# EAGLE design PatchPanel (EAGLE 6.5.0)
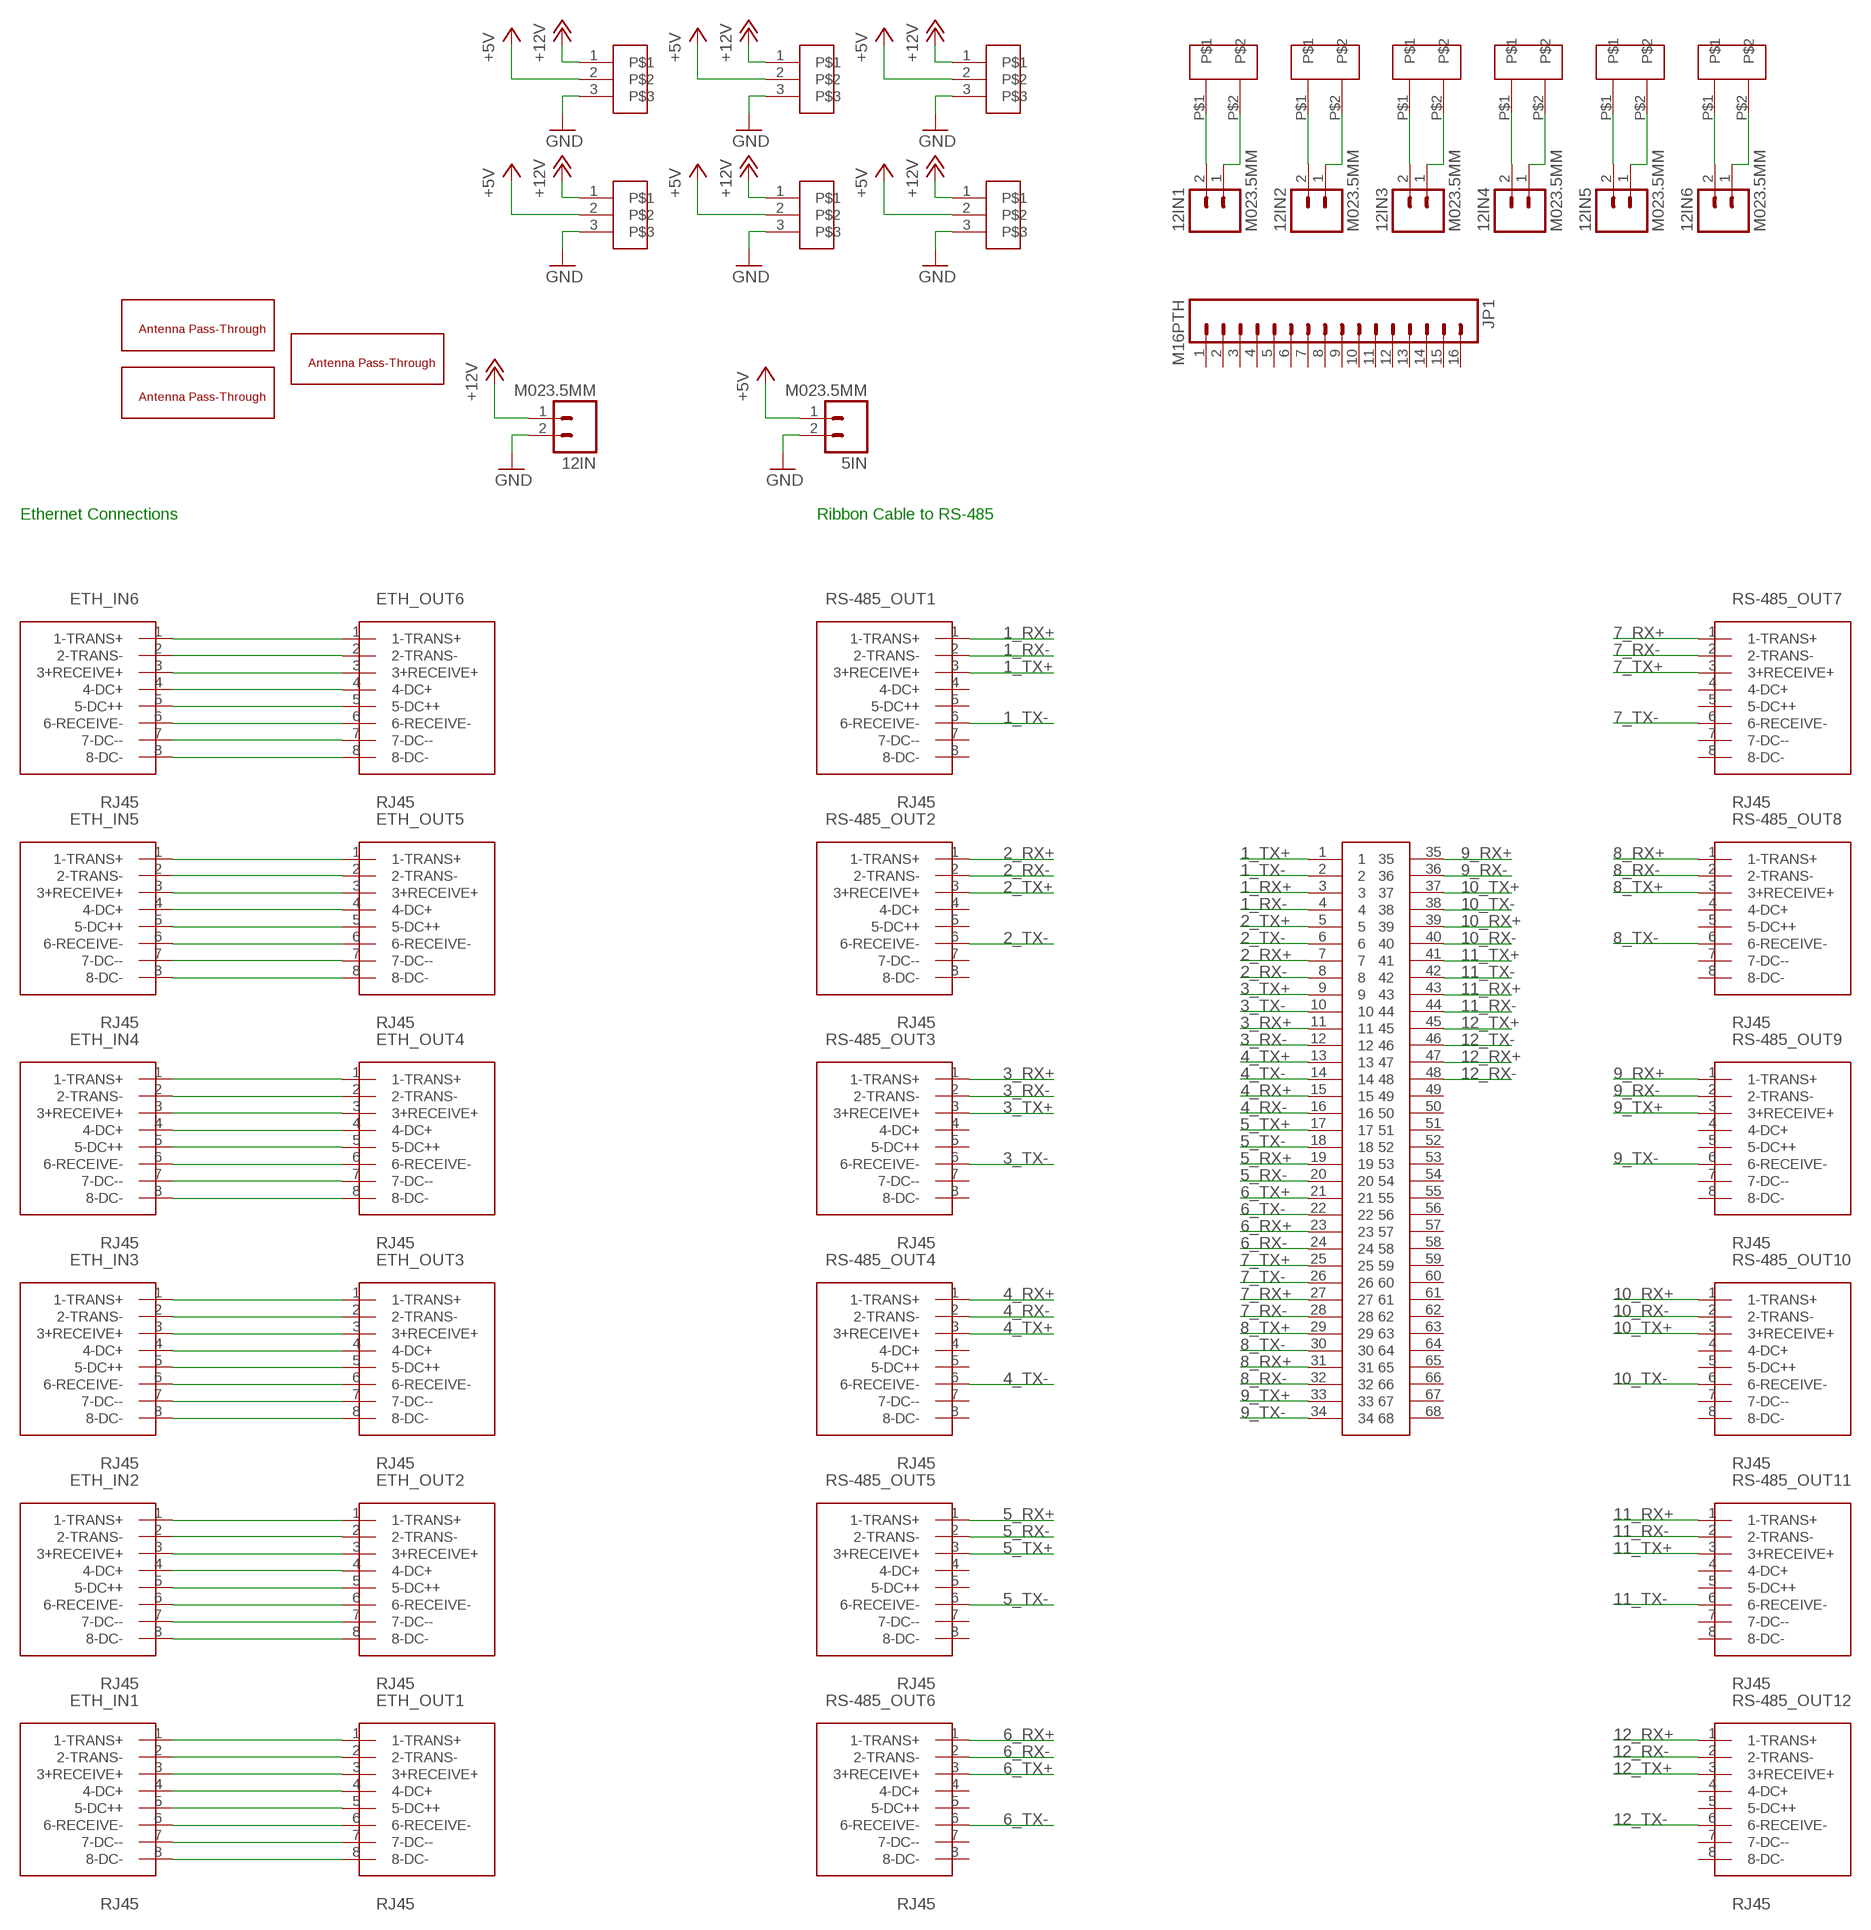
[diagram p0: schematic, sheet 1]

## Parts
5IN  M023.5MM  [SCREWTERMINAL-3.5MM-2]
12IN  M023.5MM  [SCREWTERMINAL-3.5MM-2]
12IN1  M023.5MM  [SCREWTERMINAL-3.5MM-2]
12IN2  M023.5MM  [SCREWTERMINAL-3.5MM-2]
12IN3  M023.5MM  [SCREWTERMINAL-3.5MM-2]
12IN4  M023.5MM  [SCREWTERMINAL-3.5MM-2]
12IN5  M023.5MM  [SCREWTERMINAL-3.5MM-2]
12IN6  M023.5MM  [SCREWTERMINAL-3.5MM-2]
ETH_IN1  RJ45  [RJ45-CAT5E]
ETH_IN2  RJ45  [RJ45-CAT5E]
ETH_IN3  RJ45  [RJ45-CAT5E]
ETH_IN4  RJ45  [RJ45-CAT5E]
ETH_IN5  RJ45  [RJ45-CAT5E]
ETH_IN6  RJ45  [RJ45-CAT5E]
ETH_OUT1  RJ45  [RJ45-CAT5E]
ETH_OUT2  RJ45  [RJ45-CAT5E]
ETH_OUT3  RJ45  [RJ45-CAT5E]
ETH_OUT4  RJ45  [RJ45-CAT5E]
ETH_OUT5  RJ45  [RJ45-CAT5E]
ETH_OUT6  RJ45  [RJ45-CAT5E]
JP1  M16PTH  [1X16]
RS-485_OUT1  RJ45  [RJ45-CAT5E]
RS-485_OUT2  RJ45  [RJ45-CAT5E]
RS-485_OUT3  RJ45  [RJ45-CAT5E]
RS-485_OUT4  RJ45  [RJ45-CAT5E]
RS-485_OUT5  RJ45  [RJ45-CAT5E]
RS-485_OUT6  RJ45  [RJ45-CAT5E]
RS-485_OUT7  RJ45  [RJ45-CAT5E]
RS-485_OUT8  RJ45  [RJ45-CAT5E]
RS-485_OUT9  RJ45  [RJ45-CAT5E]
RS-485_OUT10  RJ45  [RJ45-CAT5E]
RS-485_OUT11  RJ45  [RJ45-CAT5E]
RS-485_OUT12  RJ45  [RJ45-CAT5E]
U$1  TB60050685100  [60050685100]
U$2  3PIN  [0.93"]
U$3  3PIN  [0.93"]
U$4  3PIN  [0.93"]
U$5  3PIN  [0.93"]
U$6  3PIN  [0.93"]
U$7  3PIN  [0.93"]
U$8  MLX-2  [42002-2]
U$9  MLX-2  [42002-2]
U$10  MLX-2  [42002-2]
U$11  MLX-2  [42002-2]
U$12  MLX-2  [42002-2]
U$13  MLX-2  [42002-2]
U$14  N-TYPE-THRU  [N-TYPE]
U$15  N-TYPE-THRU  [N-TYPE]
U$16  SMA-THRU  [SMA]

## Nets
1_RX+: RS-485_OUT1.1(1-TRANS+) U$1.3
1_RX-: RS-485_OUT1.2(2-TRANS-) U$1.4
1_TX+: RS-485_OUT1.3(3+RECEIVE+) U$1.1
1_TX-: RS-485_OUT1.6(6-RECEIVE-) U$1.2
2_RX+: RS-485_OUT2.1(1-TRANS+) U$1.7
2_RX-: RS-485_OUT2.2(2-TRANS-) U$1.8
2_TX+: RS-485_OUT2.3(3+RECEIVE+) U$1.5
2_TX-: RS-485_OUT2.6(6-RECEIVE-) U$1.6
3_RX+: RS-485_OUT3.1(1-TRANS+) U$1.11
3_RX-: RS-485_OUT3.2(2-TRANS-) U$1.12
3_TX+: RS-485_OUT3.3(3+RECEIVE+) U$1.9
3_TX-: RS-485_OUT3.6(6-RECEIVE-) U$1.10
4_RX+: RS-485_OUT4.1(1-TRANS+) U$1.15
4_RX-: RS-485_OUT4.2(2-TRANS-) U$1.16
4_TX+: RS-485_OUT4.3(3+RECEIVE+) U$1.13
4_TX-: RS-485_OUT4.6(6-RECEIVE-) U$1.14
5_RX+: RS-485_OUT5.1(1-TRANS+) U$1.19
5_RX-: RS-485_OUT5.2(2-TRANS-) U$1.20
5_TX+: RS-485_OUT5.3(3+RECEIVE+) U$1.17
5_TX-: RS-485_OUT5.6(6-RECEIVE-) U$1.18
6_RX+: RS-485_OUT6.1(1-TRANS+) U$1.23
6_RX-: RS-485_OUT6.2(2-TRANS-) U$1.24
6_TX+: RS-485_OUT6.3(3+RECEIVE+) U$1.21
6_TX-: RS-485_OUT6.6(6-RECEIVE-) U$1.22
7_RX+: RS-485_OUT7.1(1-TRANS+) U$1.27
7_RX-: RS-485_OUT7.2(2-TRANS-) U$1.28
7_TX+: RS-485_OUT7.3(3+RECEIVE+) U$1.25
7_TX-: RS-485_OUT7.6(6-RECEIVE-) U$1.26
8_RX+: RS-485_OUT8.1(1-TRANS+) U$1.31
8_RX-: RS-485_OUT8.2(2-TRANS-) U$1.32
8_TX+: RS-485_OUT8.3(3+RECEIVE+) U$1.29
8_TX-: RS-485_OUT8.6(6-RECEIVE-) U$1.30
9_RX+: RS-485_OUT9.1(1-TRANS+) U$1.35
9_RX-: RS-485_OUT9.2(2-TRANS-) U$1.36
9_TX+: RS-485_OUT9.3(3+RECEIVE+) U$1.33
9_TX-: RS-485_OUT9.6(6-RECEIVE-) U$1.34
10_RX+: RS-485_OUT10.1(1-TRANS+) U$1.39
10_RX-: RS-485_OUT10.2(2-TRANS-) U$1.40
10_TX+: RS-485_OUT10.3(3+RECEIVE+) U$1.37
10_TX-: RS-485_OUT10.6(6-RECEIVE-) U$1.38
11_RX+: RS-485_OUT11.1(1-TRANS+) U$1.43
11_RX-: RS-485_OUT11.2(2-TRANS-) U$1.44
11_TX+: RS-485_OUT11.3(3+RECEIVE+) U$1.41
11_TX-: RS-485_OUT11.6(6-RECEIVE-) U$1.42
12_RX+: RS-485_OUT12.1(1-TRANS+) U$1.47
12_RX-: RS-485_OUT12.2(2-TRANS-) U$1.48
12_TX+: RS-485_OUT12.3(3+RECEIVE+) U$1.45
12_TX-: RS-485_OUT12.6(6-RECEIVE-) U$1.46
+5V: 5IN.1 U$2.2 U$3.2 U$4.2 U$5.2 U$6.2 U$7.2
+12V: 12IN.1 U$2.1 U$3.1 U$4.1 U$5.1 U$6.1 U$7.1
GND: 5IN.2 12IN.2 U$2.3 U$3.3 U$4.3 U$5.3 U$6.3 U$7.3
N$1: ETH_IN1.1(1-TRANS+) ETH_OUT1.1(1-TRANS+)
N$2: ETH_IN1.2(2-TRANS-) ETH_OUT1.2(2-TRANS-)
N$3: ETH_IN1.3(3+RECEIVE+) ETH_OUT1.3(3+RECEIVE+)
N$4: ETH_IN1.4(4-DC+) ETH_OUT1.4(4-DC+)
N$5: ETH_IN1.5(5-DC++) ETH_OUT1.5(5-DC++)
N$6: ETH_IN1.6(6-RECEIVE-) ETH_OUT1.6(6-RECEIVE-)
N$7: ETH_IN1.7(7-DC--) ETH_OUT1.7(7-DC--)
N$8: ETH_IN1.8(8-DC-) ETH_OUT1.8(8-DC-)
N$9: ETH_IN2.1(1-TRANS+) ETH_OUT2.1(1-TRANS+)
N$10: ETH_IN2.2(2-TRANS-) ETH_OUT2.2(2-TRANS-)
N$11: ETH_IN2.3(3+RECEIVE+) ETH_OUT2.3(3+RECEIVE+)
N$12: ETH_IN2.4(4-DC+) ETH_OUT2.4(4-DC+)
N$13: ETH_IN2.5(5-DC++) ETH_OUT2.5(5-DC++)
N$14: ETH_IN2.6(6-RECEIVE-) ETH_OUT2.6(6-RECEIVE-)
N$15: ETH_IN2.7(7-DC--) ETH_OUT2.7(7-DC--)
N$16: ETH_IN2.8(8-DC-) ETH_OUT2.8(8-DC-)
N$17: ETH_IN3.1(1-TRANS+) ETH_OUT3.1(1-TRANS+)
N$18: ETH_IN3.2(2-TRANS-) ETH_OUT3.2(2-TRANS-)
N$19: ETH_IN3.3(3+RECEIVE+) ETH_OUT3.3(3+RECEIVE+)
N$20: ETH_IN3.4(4-DC+) ETH_OUT3.4(4-DC+)
N$21: ETH_IN3.5(5-DC++) ETH_OUT3.5(5-DC++)
N$22: ETH_IN3.6(6-RECEIVE-) ETH_OUT3.6(6-RECEIVE-)
N$23: ETH_IN3.7(7-DC--) ETH_OUT3.7(7-DC--)
N$24: ETH_IN3.8(8-DC-) ETH_OUT3.8(8-DC-)
N$25: ETH_IN4.8(8-DC-) ETH_OUT4.8(8-DC-)
N$26: ETH_IN4.7(7-DC--) ETH_OUT4.7(7-DC--)
N$27: ETH_IN4.6(6-RECEIVE-) ETH_OUT4.6(6-RECEIVE-)
N$28: ETH_IN4.5(5-DC++) ETH_OUT4.5(5-DC++)
N$29: ETH_IN4.4(4-DC+) ETH_OUT4.4(4-DC+)
N$30: ETH_IN4.3(3+RECEIVE+) ETH_OUT4.3(3+RECEIVE+)
N$31: ETH_IN4.2(2-TRANS-) ETH_OUT4.2(2-TRANS-)
N$32: ETH_IN4.1(1-TRANS+) ETH_OUT4.1(1-TRANS+)
N$33: ETH_IN5.8(8-DC-) ETH_OUT5.8(8-DC-)
N$34: ETH_IN5.7(7-DC--) ETH_OUT5.7(7-DC--)
N$35: ETH_IN5.6(6-RECEIVE-) ETH_OUT5.6(6-RECEIVE-)
N$36: ETH_IN5.5(5-DC++) ETH_OUT5.5(5-DC++)
N$37: ETH_IN5.4(4-DC+) ETH_OUT5.4(4-DC+)
N$38: ETH_IN5.3(3+RECEIVE+) ETH_OUT5.3(3+RECEIVE+)
N$39: ETH_IN5.2(2-TRANS-) ETH_OUT5.2(2-TRANS-)
N$40: ETH_IN5.1(1-TRANS+) ETH_OUT5.1(1-TRANS+)
N$41: ETH_IN6.1(1-TRANS+) ETH_OUT6.1(1-TRANS+)
N$42: ETH_IN6.2(2-TRANS-) ETH_OUT6.2(2-TRANS-)
N$43: ETH_IN6.3(3+RECEIVE+) ETH_OUT6.3(3+RECEIVE+)
N$44: ETH_IN6.4(4-DC+) ETH_OUT6.4(4-DC+)
N$45: ETH_IN6.5(5-DC++) ETH_OUT6.5(5-DC++)
N$46: ETH_IN6.6(6-RECEIVE-) ETH_OUT6.6(6-RECEIVE-)
N$47: ETH_IN6.7(7-DC--) ETH_OUT6.7(7-DC--)
N$48: ETH_IN6.8(8-DC-) ETH_OUT6.8(8-DC-)
N$49: 12IN1.2 U$8.P$1
N$50: 12IN1.1 U$8.P$2
N$51: 12IN2.2 U$9.P$1
N$52: 12IN2.1 U$9.P$2
N$53: 12IN3.2 U$10.P$1
N$54: 12IN3.1 U$10.P$2
N$55: 12IN4.2 U$11.P$1
N$56: 12IN4.1 U$11.P$2
N$57: 12IN5.2 U$12.P$1
N$58: 12IN5.1 U$12.P$2
N$59: 12IN6.2 U$13.P$1
N$60: 12IN6.1 U$13.P$2
Unconnected: JP1.1 JP1.2 JP1.3 JP1.4 JP1.5 JP1.6 JP1.7 JP1.8 JP1.9 JP1.10 JP1.11 JP1.12 JP1.13 JP1.14 JP1.15 JP1.16 RS-485_OUT1.4(4-DC+) RS-485_OUT1.5(5-DC++) RS-485_OUT1.7(7-DC--) RS-485_OUT1.8(8-DC-) RS-485_OUT2.4(4-DC+) RS-485_OUT2.5(5-DC++) RS-485_OUT2.7(7-DC--) RS-485_OUT2.8(8-DC-) RS-485_OUT3.4(4-DC+) RS-485_OUT3.5(5-DC++) RS-485_OUT3.7(7-DC--) RS-485_OUT3.8(8-DC-) RS-485_OUT4.4(4-DC+) RS-485_OUT4.5(5-DC++) RS-485_OUT4.7(7-DC--) RS-485_OUT4.8(8-DC-) RS-485_OUT5.4(4-DC+) RS-485_OUT5.5(5-DC++) RS-485_OUT5.7(7-DC--) RS-485_OUT5.8(8-DC-) RS-485_OUT6.4(4-DC+) RS-485_OUT6.5(5-DC++) RS-485_OUT6.7(7-DC--) RS-485_OUT6.8(8-DC-) RS-485_OUT7.4(4-DC+) RS-485_OUT7.5(5-DC++) RS-485_OUT7.7(7-DC--) RS-485_OUT7.8(8-DC-) RS-485_OUT8.4(4-DC+) RS-485_OUT8.5(5-DC++) RS-485_OUT8.7(7-DC--) RS-485_OUT8.8(8-DC-) RS-485_OUT9.4(4-DC+) RS-485_OUT9.5(5-DC++) RS-485_OUT9.7(7-DC--) RS-485_OUT9.8(8-DC-) RS-485_OUT10.4(4-DC+) RS-485_OUT10.5(5-DC++) RS-485_OUT10.7(7-DC--) RS-485_OUT10.8(8-DC-) RS-485_OUT11.4(4-DC+) RS-485_OUT11.5(5-DC++) RS-485_OUT11.7(7-DC--) RS-485_OUT11.8(8-DC-) RS-485_OUT12.4(4-DC+) RS-485_OUT12.5(5-DC++) RS-485_OUT12.7(7-DC--) RS-485_OUT12.8(8-DC-) U$1.49 U$1.50 U$1.51 U$1.52 U$1.53 U$1.54 U$1.55 U$1.56 U$1.57 U$1.58 U$1.59 U$1.60 U$1.61 U$1.62 U$1.63 U$1.64 U$1.65 U$1.66 U$1.67 U$1.68

## Notes on the sheet
- Ethernet Connections | Ribbon Cable to RS-485

## Library data of the parts
5IN 12IN 12IN1-12IN6 = SparkFun-Connectors:M02: Standard 2-pin 0.1" header. Use with - straight break away headers ( PRT-00116) - right angle break away headers (PRT-00553) - swiss pins (PRT-00743) - machine pins (PRT-00117) - female headers (PRT-00115) Molex polarized connector foot print use with: PRT-08233 with associated crimp pins and housings. 2.54_SCREWTERM for use with PRT-10571. 3.5mm Screw Terminal footprints for PRT-08084 5mm Screw Terminal footprints for use with PRT-08433
ETH_IN1-ETH_IN6 ETH_OUT1-ETH_OUT6 RS-485_OUT1-RS-485_OUT12 = PCB0M1:RJ45
JP1 = SparkFun-Connectors:M16: 1x16 .1" header
U$1 = harting-scsi:TB60050685100
U$2-U$7 = molex-power:3PIN
U$8-U$13 = MLX:MLX-2
U$14 U$15 = ant-pass-through:N-TYPE-THRU
U$16 = ant-pass-through:SMA-THRU

## Board
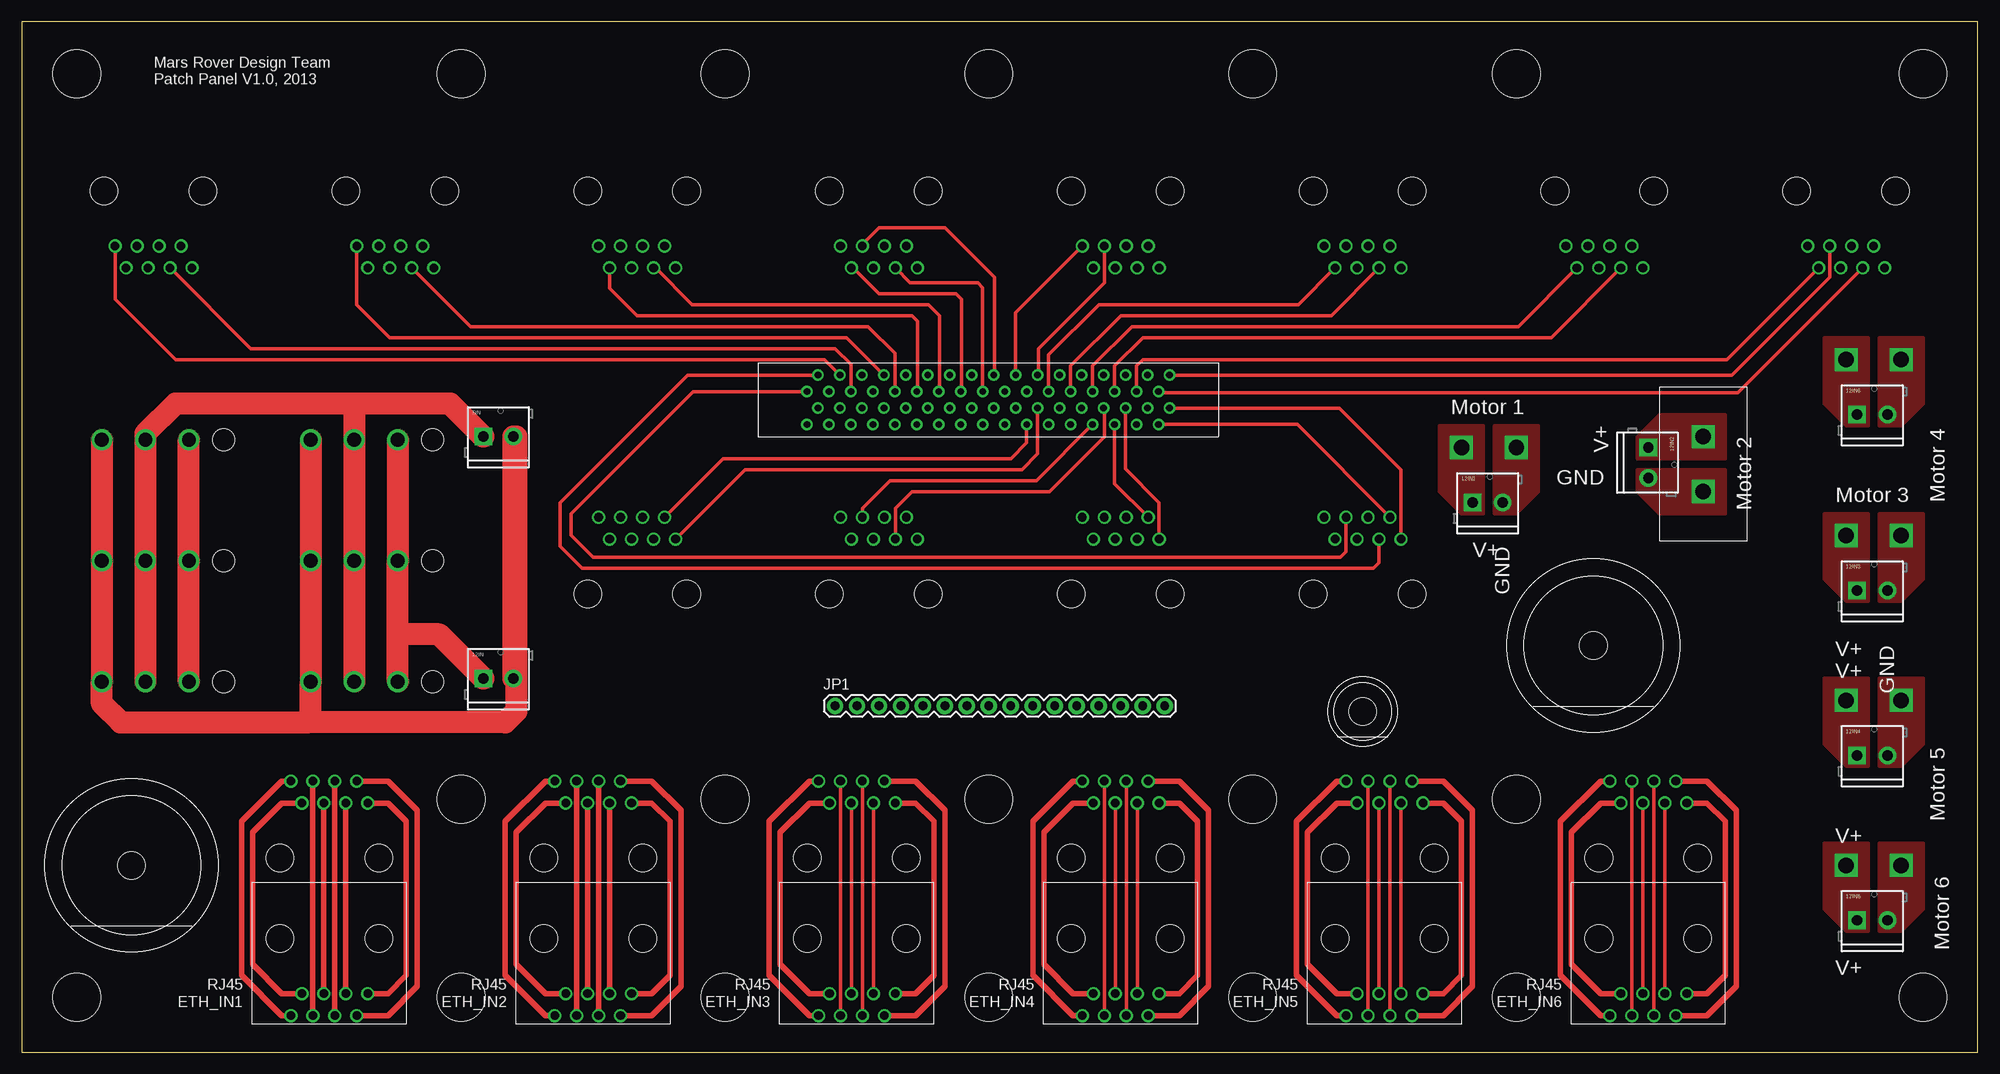
[diagram p1: board, top side]
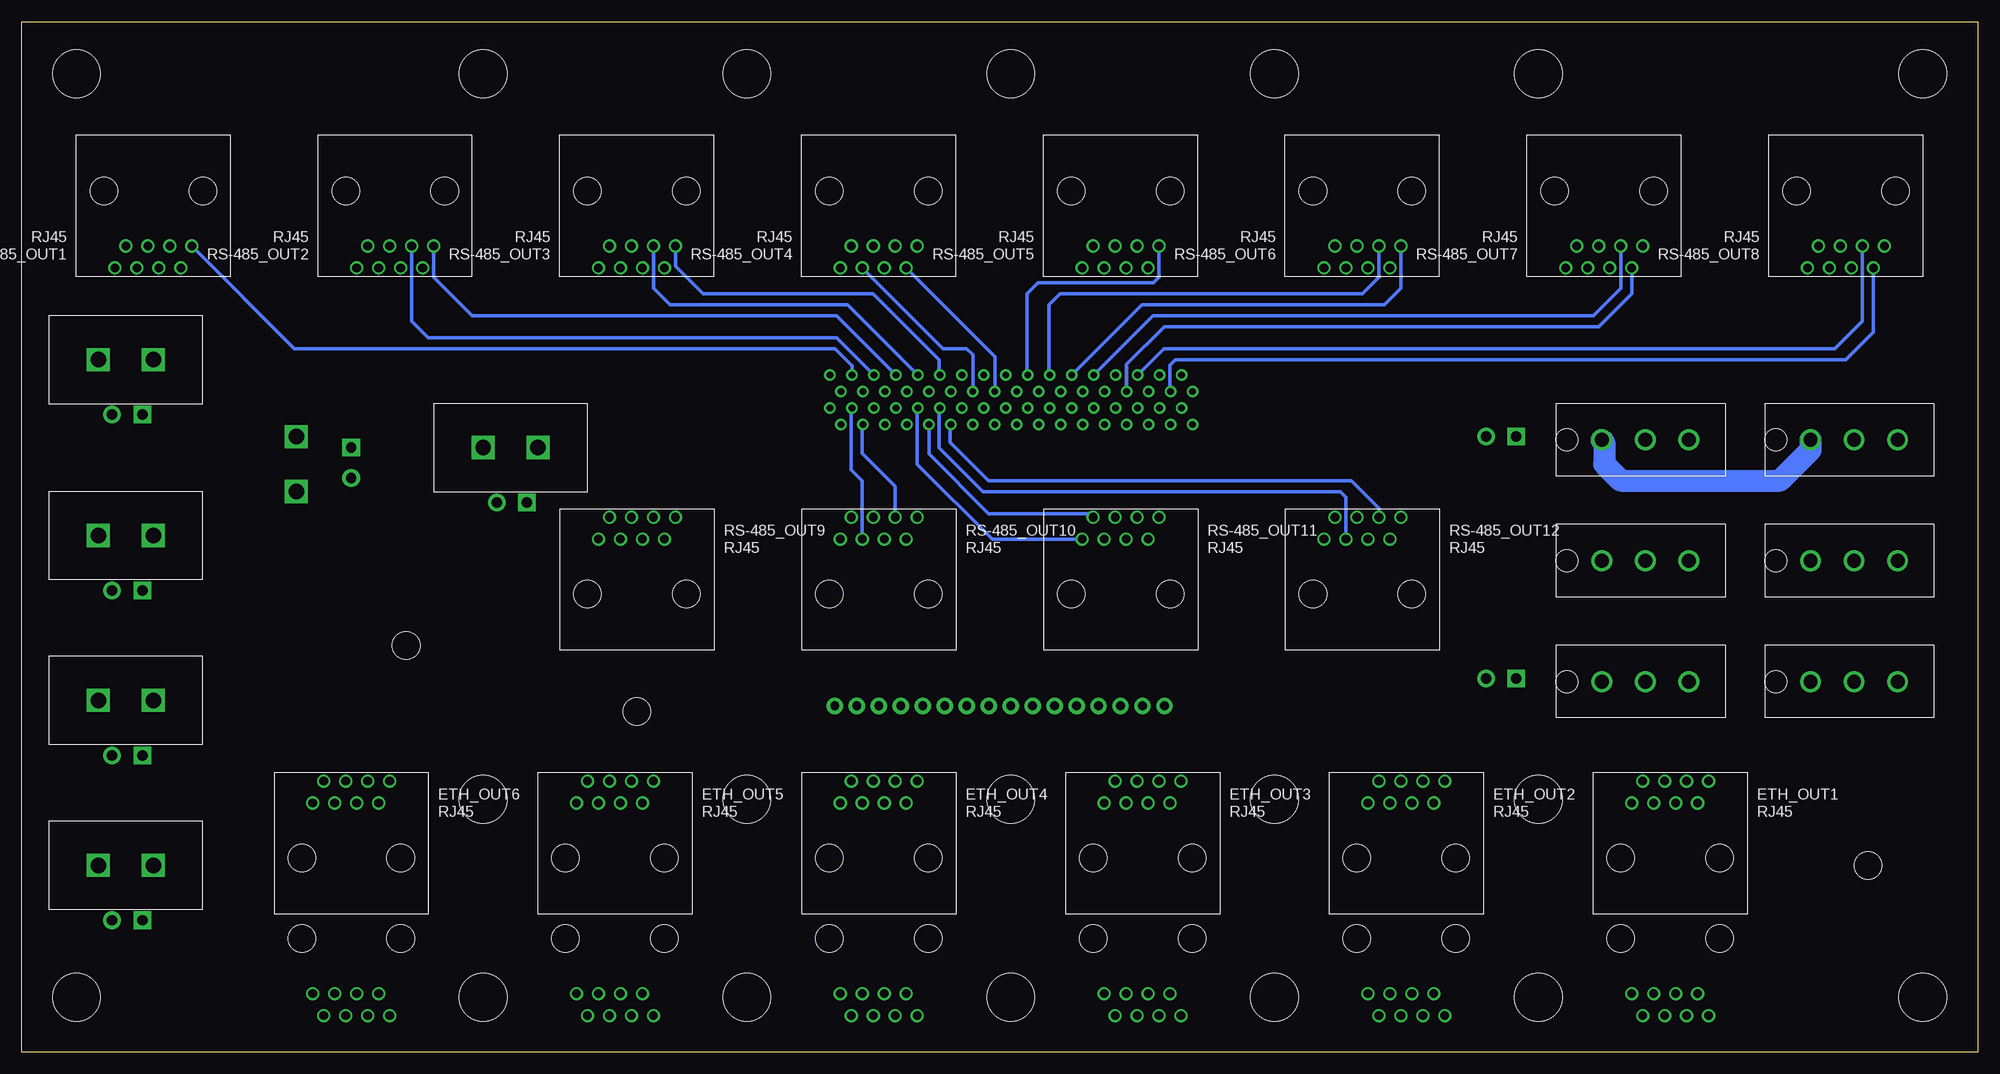
[diagram p2: board, bottom side, seen from below]

Size 226.04 x 119.05 mm. Coordinates in mm from the lower left corner, seen from the top.
Outline: 0,0 226.04,0 226.04,119.05 0,119.05 0,0
Copper layers (1*16): Top 0.035mm / dielectric 1.5mm / Bottom 0.035mm
Design rules "default": minimum track width 10mil, minimum drill 24mil, track to track 8mil, track to pad 8mil, pad to pad 8mil, via to via 8mil, smd to smd 8mil, copper to edge 40mil, drill to drill 8mil, minimum pad ring 10mil, minimum via ring 8mil, stop-mask expansion 4mil, vias tented up to drill 0mil, thermal gap 10mil
Holes 5.54 mm at 6.35,6.35 50.8,6.35 81.28,6.35 111.76,6.35 142.24,6.35 172.72,6.35 219.71,6.35 6.35,113.03 50.8,113.03 81.28,113.03 111.76,113.03 142.24,113.03 172.72,113.03 219.71,113.03 50.8,29.21 81.28,29.21 111.76,29.21 142.24,29.21 172.72,29.21

### Footprints (pad centres in the part's own frame; a part is rotated, then mirrored left to right if it is on the bottom)
SCREWTERMINAL-3.5MM-2 = drill 1.2 pad 2.032 square: 1 0,0 | drill 1.2 pad 2.032: 2 3.5,0
RJ45-CAT5E = drill 1: 1 -4.445,4.655; 2 -3.175,7.195; 3 -1.905,4.655; 4 -0.635,7.195; 5 0.635,4.655; 6 1.905,7.195; 7 3.175,4.655; 8 4.445,7.195 | hole 3.2: 5.715,-1.695; -5.715,-1.695
1X16 = drill 1.016 pad 1.88: 1 0,0; 2 2.54,0; 3 5.08,0; 4 7.62,0; 5 10.16,0; 6 12.7,0; 7 15.24,0; 8 17.78,0; 9 20.32,0; 10 22.86,0; 11 25.4,0; 12 27.94,0; 13 30.48,0; 14 33.02,0; 15 35.56,0; 16 38.1,0
60050685100 = drill 0.8: 1 47.555,7.107; 2 46.285,5.202; 3 45.015,7.107; 4 43.745,5.202; 5 42.475,7.107; 6 41.205,5.202; 7 39.935,7.107; 8 38.665,5.202; 9 37.395,7.107; 10 36.125,5.202; 11 34.855,7.107; 12 33.585,5.202; 13 32.315,7.107; 14 31.045,5.202; 15 29.775,7.107; 16 28.505,5.202; 17 27.235,7.107; 18 25.965,5.202; 19 24.695,7.107; 20 23.425,5.202; 21 22.155,7.107; 22 20.885,5.202; 23 19.615,7.107; 24 18.345,5.202; 25 17.075,7.107; 26 15.805,5.202; 27 14.535,7.107; 28 13.265,5.202; 29 11.995,7.107; 30 10.725,5.202; 31 9.455,7.107; 32 8.185,5.202; 33 6.915,7.107; 34 5.645,5.202; 35 47.555,3.297; 36 46.285,1.393; 37 45.015,3.297; 38 43.745,1.393; 39 42.475,3.297; 40 41.205,1.393; 41 39.935,3.297; 42 38.665,1.393; 43 37.395,3.297; 44 36.125,1.393; 45 34.855,3.297; 46 33.585,1.393; 47 32.315,3.297; 48 31.045,1.393; 49 29.775,3.297; 50 28.505,1.393; 51 27.235,3.297; 52 25.965,1.393; 53 24.695,3.297; 54 23.425,1.393; 55 22.155,3.297; 56 20.885,1.393; 57 19.615,3.297; 58 18.345,1.393; 59 17.075,3.297; 60 15.805,1.393; 61 14.535,3.297; 62 13.265,1.393; 63 11.995,3.297; 64 10.725,1.393; 65 9.455,3.297; 66 8.185,1.393; 67 6.915,3.297; 68 5.645,1.393
0.93" = drill 1.6: 1 14.249,4.191; 2 9.22,4.191; 3 4.191,4.191 | hole 2.54: 18.263,4.191
42002-2 = drill 1.778 square: P$1 0,0; P$2 6.35,0
N-TYPE = hole 3.2: 0,0
SMA = hole 3.2: 0,0

### Placement (x,y rotation side)
5IN  53.34,71.12 0 top
12IN  53.34,43.18 0 top
12IN1  167.64,63.5 0 top
12IN2  187.96,69.85 270 top
12IN3  212.09,53.34 0 top
12IN4  212.09,34.29 0 top
12IN5  212.09,15.24 0 top
12IN6  212.09,73.66 0 top
ETH_IN1  35.56,11.43 180 top
ETH_IN2  66.04,11.43 180 top
ETH_IN3  96.52,11.43 180 top
ETH_IN4  127,11.43 180 top
ETH_IN5  157.48,11.43 180 top
ETH_IN6  187.96,11.43 180 top
ETH_OUT1  35.56,24.13 0 bottom
ETH_OUT2  66.04,24.13 0 bottom
ETH_OUT3  96.52,24.13 0 bottom
ETH_OUT4  127,24.13 0 bottom
ETH_OUT5  157.48,24.13 0 bottom
ETH_OUT6  187.96,24.13 0 bottom
JP1  93.98,40.01 0 top
RS-485_OUT1  210.82,97.79 180 bottom
RS-485_OUT2  182.88,97.79 180 bottom
RS-485_OUT3  154.94,97.79 180 bottom
RS-485_OUT4  127,97.79 180 bottom
RS-485_OUT5  99.06,97.79 180 bottom
RS-485_OUT6  71.12,97.79 180 bottom
RS-485_OUT7  43.18,97.79 180 bottom
RS-485_OUT8  15.24,97.79 180 bottom
RS-485_OUT9  154.94,54.61 0 bottom
RS-485_OUT10  127,54.61 0 bottom
RS-485_OUT11  99.06,54.61 0 bottom
RS-485_OUT12  71.12,54.61 0 bottom
U$1  85.09,71.12 0 top
U$2  5.08,74.93 180 bottom
U$3  29.21,74.93 180 bottom
U$4  5.08,60.96 180 bottom
U$5  29.21,60.96 180 bottom
U$6  5.08,46.99 180 bottom
U$7  29.21,46.99 180 bottom
U$8  172.72,69.85 0 bottom
U$9  194.31,64.77 90 top
U$10  217.17,59.69 0 bottom
U$11  217.17,40.64 0 bottom
U$12  217.17,21.59 0 bottom
U$13  217.17,80.01 0 bottom
U$14  12.7,21.59 0 top
U$15  181.61,46.99 0 top
U$16  154.94,39.37 0 top

### Tracks (layer width: path | path; a pad name or v marks a point on that pad's centre or on a via)
1_RX+
  Bottom 0.406: RS-485_OUT1.1 194.52,81.28 132.08,81.28 130.1,79.31 U$1.3
1_RX-
  Top 0.406: RS-485_OUT1.2 197.06,80.01 129.54,80.01 128.84,79.31 U$1.4
1_TX+
  Top 0.406: RS-485_OUT1.3 208.91,89.53 197.61,78.23 U$1.1
1_TX-
  Top 0.406: RS-485_OUT1.6 198.33,76.2 132.08,76.2 131.96,76.32 U$1.2
2_RX+
  Bottom 0.406: U$1.7 131.89,85.09 173.99,85.09 178.44,89.53 RS-485_OUT2.1
2_RX-
  Top 0.406: RS-485_OUT2.2 172.93,83.82 128.27,83.82 123.75,79.31 U$1.8
2_TX+
  Bottom 0.406: U$1.5 131.89,82.55 179.07,82.55 180.97,84.45 RS-485_OUT2.3
2_TX-
  Top 0.406: RS-485_OUT2.6 176.74,82.55 129.54,82.55 126.3,79.31 U$1.6
3_RX+
  Bottom 0.406: U$1.11 120.02,78.3 120.02,80.01 127.64,87.63 147.32,87.63 150.5,90.81 RS-485_OUT3.1
3_RX-
  Top 0.406: RS-485_OUT3.2 147.53,86.36 124.46,86.36 118.67,80.58 U$1.12
3_TX+
  Bottom 0.406: U$1.9 130.62,86.36 151.13,86.36 153.03,88.27 RS-485_OUT3.3
3_TX-
  Top 0.406: RS-485_OUT3.6 151.34,85.09 127,85.09 121.22,79.31 U$1.10
4_RX+
  Top 0.406: RS-485_OUT4.1 114.86,85.44 U$1.15
4_RX-
  Bottom 0.406: RS-485_OUT4.2 113.59,80.36 U$1.16
4_TX+
  Top 0.406: U$1.13 117.47,78.3 117.47,81.28 125.09,88.9 RS-485_OUT4.3
4_TX-
  Bottom 0.406: RS-485_OUT4.6 119.59,81.28 116.84,81.28 116.14,80.58 U$1.14
5_RX+
  Bottom 0.406: U$1.19 109.86,78.3 109.86,87.63 108.58,88.9 95.25,88.9 94.61,89.53 RS-485_OUT5.1
5_RX-
  Top 0.406: U$1.20 108.58,76.39 108.58,87 107.95,87.63 99.06,87.63 96.09,90.59 RS-485_OUT5.2
5_TX+
  Top 0.406: U$1.17 112.39,78.3 112.39,89.53 106.68,95.25 99.06,95.25 97.16,93.34 RS-485_OUT5.3
5_TX-
  Top 0.406: U$1.18 111.06,88.33 110.49,88.9 102.66,88.9 RS-485_OUT5.6
6_RX+
  Bottom 0.406: U$1.23 96.57,86.36 68.58,86.36 66.67,88.27 RS-485_OUT6.1
6_RX-
  Top 0.406: U$1.24 103.5,76.39 103.5,84.45 102.87,85.09 71.12,85.09 67.94,88.27 RS-485_OUT6.2
6_TX+
  Bottom 0.406: U$1.21 107.31,78.3 107.31,86.36 106.05,87.63 71.12,87.63 69.22,89.53 RS-485_OUT6.3
6_TX-
  Top 0.406: U$1.22 106.05,76.39 106.05,85.09 104.78,86.36 77.47,86.36 73.23,90.59 RS-485_OUT6.6
7_RX+
  Top 0.406: U$1.27 95.3,82.55 42.55,82.55 38.73,86.36 RS-485_OUT7.1
7_RX-
  Bottom 0.406: RS-485_OUT7.2 40.01,87.63 43.81,83.82 93.98,83.82 98.36,79.44 U$1.28
7_TX+
  Bottom 0.406: U$1.25 95.3,85.09 44.45,85.09 41.27,88.27 RS-485_OUT7.3
7_TX-
  Top 0.406: RS-485_OUT7.6 51.86,83.82 97.79,83.82 100.89,80.72 U$1.26
8_RX+
  Top 0.406: U$1.31 92.76,80.01 17.78,80.01 10.79,87 RS-485_OUT8.1
8_RX-
  Bottom 0.406: U$1.32 93.34,76.39 93.34,79.38 92.71,80.01 15.24,80.01 12.06,83.19 RS-485_OUT8.2
8_TX+
  Bottom 0.406: U$1.29 94.03,81.28 16.51,81.28 13.34,84.45 RS-485_OUT8.3
8_TX-
  Top 0.406: RS-485_OUT8.6 26.46,81.28 93.98,81.28 95.81,79.44 U$1.30
9_RX+
  Top 0.406: RS-485_OUT9.1 159.38,67.31 152.28,74.42 U$1.35
9_RX-
  Top 0.406: RS-485_OUT9.2 147.41,72.51 U$1.36
9_TX+
  Top 0.406: RS-485_OUT9.3 156.84,56.52 156.21,55.88 64.77,55.88 62.23,58.42 62.23,63.5 76.96,78.23 U$1.33
9_TX-
  Top 0.406: RS-485_OUT9.6 153.03,57.78 152.4,57.15 66.04,57.15 63.5,59.69 63.5,62.23 77.59,76.32 U$1.34
10_RX+
  Top 0.406: RS-485_OUT10.1 131.44,63.5 127.56,67.38 U$1.39
10_RX-
  Top 0.406: RS-485_OUT10.2 126.3,65.69 U$1.40
10_TX+
  Bottom 0.406: U$1.37 130.18,74.35 130.18,67.31 128.91,66.04 RS-485_OUT10.3
10_TX-
  Bottom 0.406: U$1.38 128.91,72.44 128.91,69.22 125.09,65.41 RS-485_OUT10.6
11_RX+
  Bottom 0.406: U$1.43 122.56,74.35 122.56,67.94 113.88,59.27 RS-485_OUT11.1
11_RX-
  Bottom 0.406: RS-485_OUT11.2 102.66,62.23 114.3,62.23 121.22,69.14 U$1.44
11_TX+
  Top 0.406: U$1.41 125.09,74.35 125.09,71.12 118.75,64.77 102.87,64.77 100.97,62.87 RS-485_OUT11.3
11_TX-
  Top 0.406: U$1.42 117.28,66.04 100.33,66.04 97.16,62.87 RS-485_OUT11.6
12_RX+
  Top 0.406: RS-485_OUT12.1 83.61,67.31 115.57,67.31 117.41,69.14 U$1.47
12_RX-
  Top 0.406: RS-485_OUT12.2 81.07,68.58 114.3,68.58 116.14,70.42 U$1.48
12_TX+
  Bottom 0.406: U$1.45 120.02,74.35 120.02,69.85 114.94,64.77 73.66,64.77 73.03,64.14 RS-485_OUT12.3
12_TX-
  Bottom 0.406: U$1.46 118.75,72.44 118.75,70.48 114.3,66.04 72.39,66.04 69.22,62.87 RS-485_OUT12.6
+5V
  Top 2.54: U$6.2 U$4.2 U$2.2 14.3,71.45 17.78,74.93 38.43,74.93 | U$7.2 U$5.2 U$3.2 38.43,74.93 | 5IN.1 49.53,74.93 38.43,74.93
+12V
  Top 2.54: U$6.1 U$4.1 U$2.1 | U$3.1 U$5.1 43.46,48.26 | U$7.1 43.46,48.26 | 12IN.1 48.26,48.26 43.46,48.26
  Bottom 2.54: U$3.1 43.18,70.46 43.18,67.94 41.27,66.04 22.86,66.04 19.33,69.57 U$2.1
GND
  Top 2.54: U$2.3 U$4.3 U$6.3 9.27,40.26 11.43,38.1 33.02,38.1 | U$3.3 U$5.3 U$7.3 33.4,38.48 33.02,38.1 | 12IN.2 5IN.2 57.15,71.12 57.15,39.37 55.88,38.1 33.02,38.1
N$1
  Top 0.61: ETH_IN1.1 42.34,6.78 44.45,8.89 44.45,26.67 42.34,28.79 ETH_OUT1.1
N$2
  Top 0.61: ETH_IN1.2 42.34,4.24 45.72,7.62 45.72,27.94 42.34,31.32 ETH_OUT1.2
N$3
  Top 0.61: ETH_OUT1.3 ETH_IN1.3
N$4
  Top 0.61: ETH_OUT1.4 ETH_IN1.4
N$5
  Top 0.61: ETH_OUT1.5 ETH_IN1.5
N$6
  Top 0.61: ETH_OUT1.6 ETH_IN1.6
N$7
  Top 0.61: ETH_IN1.7 30.05,6.78 26.67,10.16 26.67,25.4 30.05,28.79 ETH_OUT1.7
N$8
  Top 0.61: ETH_IN1.8 30.05,4.24 25.4,8.89 25.4,26.67 30.05,31.32 ETH_OUT1.8
N$9
  Top 0.61: ETH_IN2.1 72.81,6.78 74.93,8.89 74.93,26.67 72.81,28.79 ETH_OUT2.1
N$10
  Top 0.61: ETH_IN2.2 72.81,4.24 76.2,7.62 76.2,27.94 72.81,31.32 ETH_OUT2.2
N$11
  Top 0.61: ETH_OUT2.3 ETH_IN2.3
N$12
  Top 0.61: ETH_IN2.4 ETH_OUT2.4
N$13
  Top 0.61: ETH_OUT2.5 ETH_IN2.5
N$14
  Top 0.61: ETH_OUT2.6 ETH_IN2.6
N$15
  Top 0.61: ETH_IN2.7 60.53,6.78 57.15,10.16 57.15,25.4 60.53,28.79 ETH_OUT2.7
N$16
  Top 0.61: ETH_IN2.8 60.53,4.24 55.88,8.89 55.88,26.67 60.53,31.32 ETH_OUT2.8
N$17
  Top 0.61: ETH_IN3.1 103.3,6.78 105.41,8.89 105.41,26.67 103.3,28.79 ETH_OUT3.1
N$18
  Top 0.61: ETH_IN3.2 103.3,4.24 106.68,7.62 106.68,27.94 103.3,31.32 ETH_OUT3.2
N$19
  Top 0.406: ETH_IN3.3 ETH_OUT3.3
N$20
  Top 0.406: ETH_OUT3.4 ETH_IN3.4
N$21
  Top 0.406: ETH_OUT3.5 ETH_IN3.5
N$22
  Top 0.406: ETH_OUT3.6 ETH_IN3.6
N$23
  Top 0.61: ETH_IN3.7 91.02,6.78 87.63,10.16 87.63,25.4 91.02,28.79 ETH_OUT3.7
N$24
  Top 0.61: ETH_IN3.8 91.02,4.24 86.36,8.89 86.36,26.67 91.02,31.32 ETH_OUT3.8
N$25
  Top 0.61: ETH_IN4.8 121.5,4.24 116.84,8.89 116.84,26.67 121.5,31.32 ETH_OUT4.8
N$26
  Top 0.61: ETH_IN4.7 121.5,6.78 118.11,10.16 118.11,25.4 121.5,28.79 ETH_OUT4.7
N$27
  Top 0.406: ETH_IN4.6 ETH_OUT4.6
N$28
  Top 0.406: ETH_OUT4.5 ETH_IN4.5
N$29
  Top 0.406: ETH_IN4.4 ETH_OUT4.4
N$30
  Top 0.406: ETH_OUT4.3 ETH_IN4.3
N$31
  Top 0.61: ETH_IN4.2 133.78,4.24 137.16,7.62 137.16,27.94 133.78,31.32 ETH_OUT4.2
N$32
  Top 0.61: ETH_IN4.1 133.78,6.78 135.89,8.89 135.89,26.67 133.78,28.79 ETH_OUT4.1
N$33
  Top 0.61: ETH_IN5.8 151.97,4.24 147.32,8.89 147.32,26.67 151.97,31.32 ETH_OUT5.8
N$34
  Top 0.61: ETH_IN5.7 151.97,6.78 148.59,10.16 148.59,25.4 151.97,28.79 ETH_OUT5.7
N$35
  Top 0.406: ETH_OUT5.6 ETH_IN5.6
N$36
  Top 0.406: ETH_OUT5.5 ETH_IN5.5
N$37
  Top 0.406: ETH_IN5.4 ETH_OUT5.4
N$38
  Top 0.406: ETH_OUT5.3 ETH_IN5.3
N$39
  Top 0.61: ETH_IN5.2 164.25,4.24 167.64,7.62 167.64,27.94 164.25,31.32 ETH_OUT5.2
N$40
  Top 0.61: ETH_IN5.1 164.25,6.78 166.37,8.89 166.37,26.67 164.25,28.79 ETH_OUT5.1
N$41
  Top 0.61: ETH_IN6.1 194.74,6.78 196.85,8.89 196.85,26.67 194.74,28.79 ETH_OUT6.1
N$42
  Top 0.61: ETH_IN6.2 194.74,4.24 198.12,7.62 198.12,27.94 194.74,31.32 ETH_OUT6.2
N$43
  Top 0.406: ETH_OUT6.3 ETH_IN6.3
N$44
  Top 0.406: ETH_IN6.4 ETH_OUT6.4
N$45
  Top 0.406: ETH_OUT6.5 ETH_IN6.5
N$46
  Top 0.406: ETH_IN6.6 ETH_OUT6.6
N$47
  Top 0.61: ETH_IN6.7 182.46,6.78 179.07,10.16 179.07,25.4 182.46,28.79 ETH_OUT6.7
N$48
  Top 0.61: ETH_IN6.8 182.46,4.24 177.8,8.89 177.8,26.67 182.46,31.32 ETH_OUT6.8
N$49
  pour Top (no thermals): 170.18,72.39 170.18,62.23 172.72,62.23 175.26,64.77 175.26,72.39
N$50
  pour Top (no thermals): 168.91,62.23 168.91,72.39 163.83,72.39 163.83,64.77 166.37,62.23
N$51
  pour Top (no thermals): 196.85,67.31 186.69,67.31 186.69,64.77 189.23,62.23 196.85,62.23
N$52
  pour Top (no thermals): 186.69,68.58 196.85,68.58 196.85,73.66 189.23,73.66 186.69,71.12
N$53
  pour Top (no thermals): 214.63,62.23 214.63,52.07 217.17,52.07 219.71,54.61 219.71,62.23
N$54
  pour Top (no thermals): 213.36,52.07 213.36,62.23 208.28,62.23 208.28,54.61 210.82,52.07
N$55
  pour Top (no thermals): 214.63,43.18 214.63,33.02 217.17,33.02 219.71,35.56 219.71,43.18
N$56
  pour Top (no thermals): 213.36,33.02 213.36,43.18 208.28,43.18 208.28,35.56 210.82,33.02
N$57
  pour Top (no thermals): 214.63,24.13 214.63,13.97 217.17,13.97 219.71,16.51 219.71,24.13
N$58
  pour Top (no thermals): 213.36,13.97 213.36,24.13 208.28,24.13 208.28,16.51 210.82,13.97
N$59
  pour Top (no thermals): 214.63,82.55 214.63,72.39 217.17,72.39 219.71,74.93 219.71,82.55
N$60
  pour Top (no thermals): 213.36,72.39 213.36,82.55 208.28,82.55 208.28,74.93 210.82,72.39

### Text on the board
_tsilk: Mars Rover Design Team / Patch Panel V1.0, 2013 | Motor 1 | V+ | Motor 2 | GND | Motor 3 | Motor 4 | GND | V+ | GND | V+ | V+ | Motor 5 | V+ | Motor 6 | V+